# EAGLE schematic controller (EAGLE 6.1)
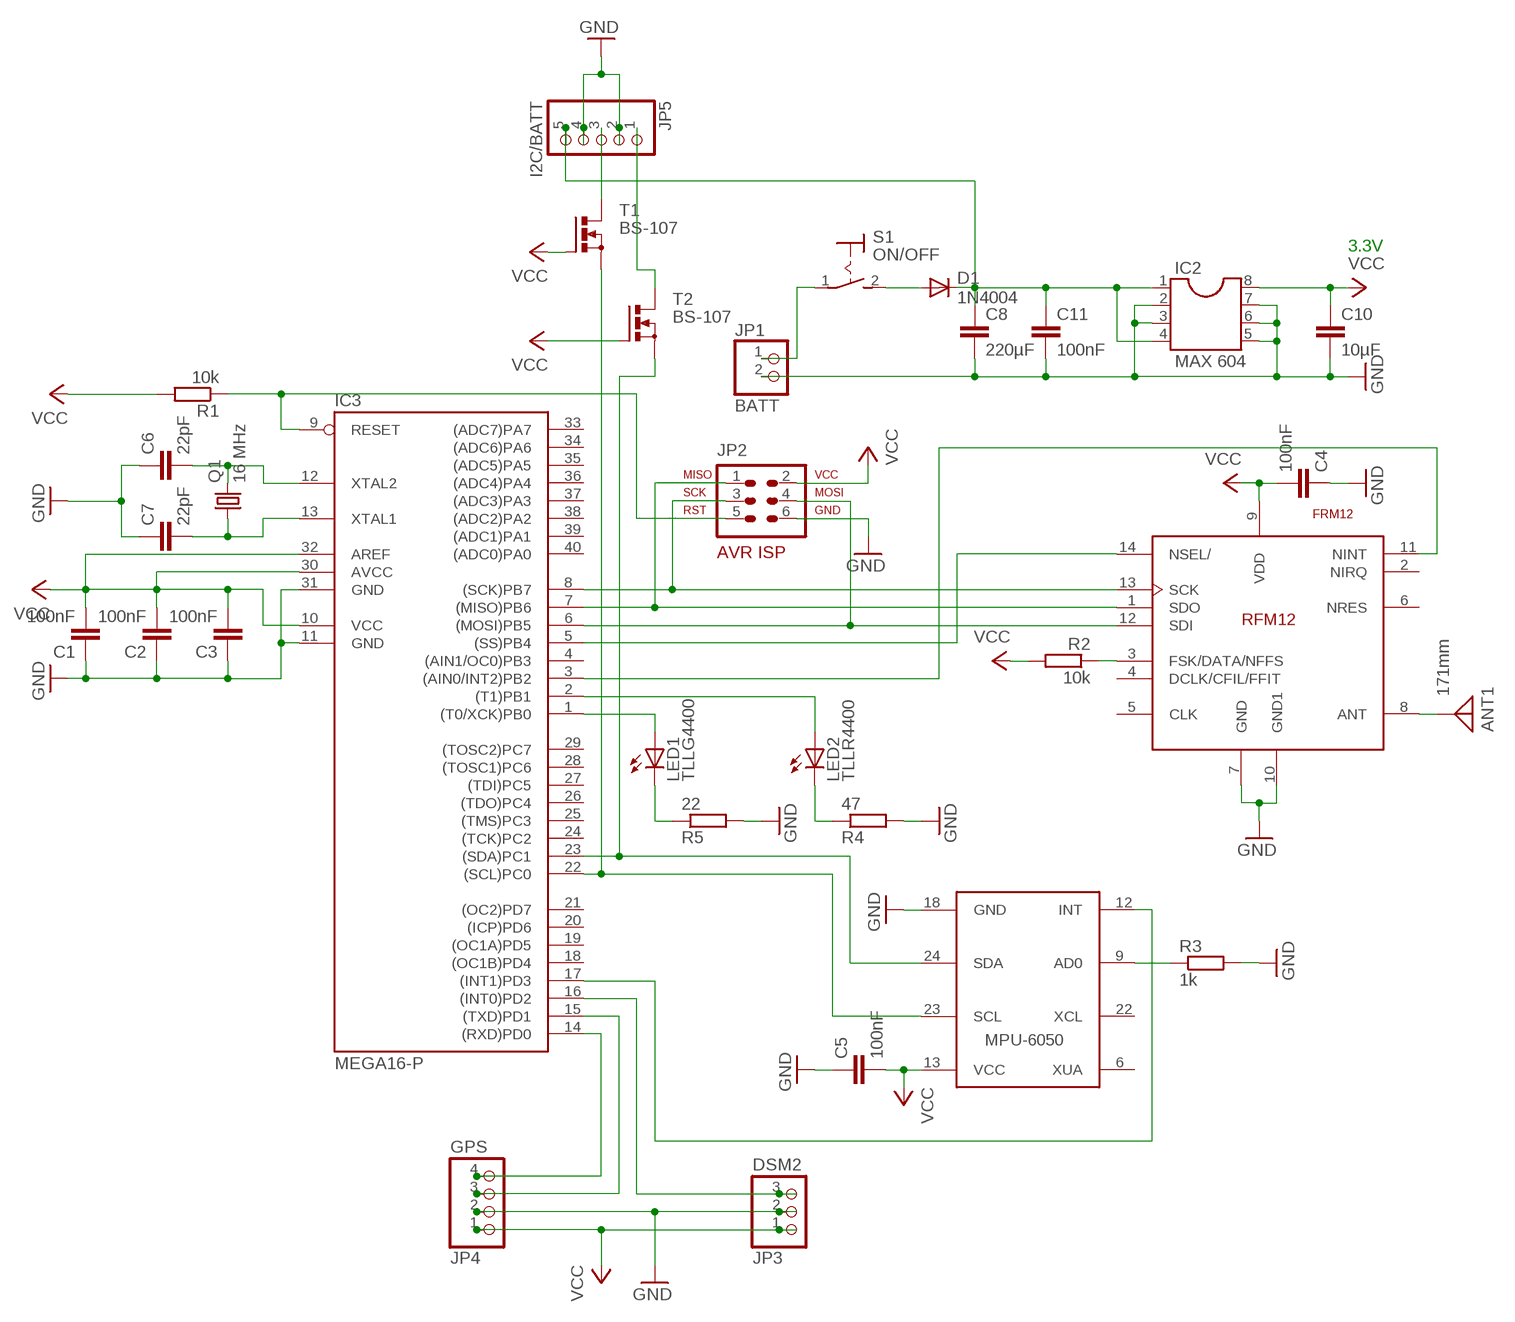
[diagram p0: schematic, sheet 1]

## Parts
ANT1  171mm  ANTENNA  [PAD-01]
C1  100nF  C2.5/2  [C2.5-2]
C2  100nF  C2.5/2  [C2.5-2]
C3  100nF  C2.5/2  [C2.5-2]
C4  100nF  C2.5/2  [C2.5-2]
C5  100nF  C2.5/2  [C2.5-2]
C6  22pF  C2.5/2  [C2.5-2]
C7  22pF  C2.5/2  [C2.5-2]
C8  220µF  C2.5/6  [C2.5-6]
C10  10µF  C2.5/5  [C2.5-5]
C11  100nF  C2.5/2  [C2.5-2]
D1  1N4004  [DO41-10]
IC2  MAX 604  DIL8S  [SOCKET-08]
IC3  MEGA16-P  [DIL40]
JP1  BATT  PINHD-1X2  [1X02]
JP2  AVR-ISP-6VERT  [AVR-ISP-6]
JP3  DSM2  PINHD-1X3  [1X03]
JP4  GPS  PINHD-1X4  [1X04]
JP5  I2C/BATT  PINHD-1X5  [1X05]
LED1  TLLG4400  [LED3MM]
LED2  TLLR4400  [LED3MM]
Q1  16 MHz  CRYSTALHC49S  [HC49/S]
R1  10k  R-EU_0207/10  [0207/10]
R2  10k  R-EU_0207/10  [0207/10]
R3  1k  R-EU_0207/10  [0207/10]
R4  47  R-EU_0207/10  [0207/10]
R5  22  R-EU_0207/10  [0207/10]
S1  ON/OFF  MS243  [MS243]
T1  BS-107  PMOSFET_NTO220BV  [TO220BV]
T2  BS-107  PMOSFET_NTO220BV  [TO220BV]
U$1  MPU-6050  [MPU-6050]
U$2  FRM12  [RFM12]

## Nets
GND: C1.1 C2.1 C3.1 C4.1 C5.1 C6.1 C7.1 C8.2 C10.2 C11.2 IC2.2 IC2.3 IC2.5 IC2.6 IC2.7 IC3.11(GND) IC3.31(GND) JP1.2 JP2.6 JP3.2 JP4.2 JP5.2 JP5.4 R3.2 R4.2 R5.2 U$1.18(GND) U$2.7(GND) U$2.10(GND1)
N$1: C6.2 IC3.12(XTAL2) Q1.2
N$2: C7.2 IC3.13(XTAL1) Q1.1
N$3: IC3.3((AIN0/INT2)PB2) U$2.11(NINT)
N$4: D1.A S1.2(S)
N$5: R3.1 U$1.9(AD0)
N$6: JP1.1 S1.1(P)
N$7: IC3.15((TXD)PD1) JP4.3
N$8: IC3.14((RXD)PD0) JP4.4
N$9: IC3.9(RESET) JP2.5 R1.1
N$10: IC3.17((INT1)PD3) U$1.12(INT)
N$12: IC3.6((MOSI)PB5) JP2.4 U$2.12(SDI)
N$13: IC3.5((SS)PB4) U$2.14(NSEL/)
N$14: IC3.7((MISO)PB6) JP2.1 U$2.1(SDO)
N$15: IC3.8((SCK)PB7) JP2.3 U$2.13(SCK)
N$16: IC3.1((T0/XCK)PB0) LED1.A
N$17: IC3.22((SCL)PC0) T1.S U$1.23(SCL)
N$18: IC3.23((SDA)PC1) T2.S U$1.24(SDA)
N$19: IC3.2((T1)PB1) LED2.A
N$20: LED1.K(C) R5.1
N$21: LED2.K(C) R4.1
N$24: C8.1 C11.1 D1.C IC2.1 IC2.4 JP5.5
N$25: JP5.3 T1.D
N$26: JP5.1 T2.D
N$38: R2.1 U$2.3(FSK/DATA/NFFS)
N$42: ANT1.1 U$2.8(ANT)
N$54: IC3.16((INT0)PD2) JP3.3
VCC: C1.2 C2.2 C3.2 C5.2 C10.1 IC2.8 IC3.10(VCC) IC3.30(AVCC) IC3.32(AREF) JP2.2 JP3.1 JP4.1 R1.2 R2.2 T1.G T2.G U$1.13(VCC)
VDD: C4.2 U$2.9(VDD) ; supply symbol labelled VCC
Unconnected: IC3.4((AIN1/OC0)PB3) IC3.18((OC1B)PD4) IC3.19((OC1A)PD5) IC3.20((ICP)PD6) IC3.21((OC2)PD7) IC3.24((TCK)PC2) IC3.25((TMS)PC3) IC3.26((TDO)PC4) IC3.27((TDI)PC5) IC3.28((TOSC1)PC6) IC3.29((TOSC2)PC7) IC3.33((ADC7)PA7) IC3.34((ADC6)PA6) IC3.35((ADC5)PA5) IC3.36((ADC4)PA4) IC3.37((ADC3)PA3) IC3.38((ADC2)PA2) IC3.39((ADC1)PA1) IC3.40((ADC0)PA0) U$1.6(XUA) U$1.22(XCL) U$2.2(NIRQ) U$2.4(DCLK/CFIL/FFIT) U$2.5(CLK) U$2.6(NRES)

## Notes on the sheet
- 3.3V

## Library data of the parts
ANT1 = discrete:ANTENNA: Antenna
C1-C8 C10 C11 = capacitor-wima:C: CAPACITOR naming: grid - package width
D1 = diode:1N4004: DIODE general purpose rectifier, 1 A
IC2 = ic-package:DIL8: Dual In Line / Socket
IC3 = atmel:MEGA16-P: MICROCONTROLLER 16 Kbytes FLASH 1 kbytes SRAM 512 bytes EEPROM USART 8-channel 10 bit ADC Source: avr.lbr; MPN: ATMEGA16-16PU; OC_FARNELL: 9171142; OC_NEWARK: 01M6885
JP1 = pinhead:PINHD-1X2: PIN HEADER
JP2 = avr-7:AVR-ISP-6: AVR ISP-6 Serial Programming Header
JP3 = pinhead:PINHD-1X3: PIN HEADER
JP4 = pinhead:PINHD-1X4: PIN HEADER
JP5 = pinhead:PINHD-1X5: PIN HEADER
LED1 = led:TLLG4400: Low Current (2mA) LED 3 mm Tinted Diffused Package color GREEN Source: Data sheet <http://www.farnell.com/datasheets/391098.pdf>; MF: VISHAY SEMICONDUCTOR; OC_FARNELL: 1612435
LED2 = led:TLLR4400: Low Current (2mA) LED 3 mm Tinted Diffused Package color RED Source: Data sheet <http://www.farnell.com/datasheets/391100.pdf>; MF: VISHAY SEMICONDUCTOR; OC_FARNELL: 1612437
Q1 = crystal:CRYSTAL: CRYSTAL; OC_FARNELL: 1667008; OC_NEWARK: unknown
R1-R5 = resistor:R-EU_: RESISTOR, European symbol
S1 = switch:MS243: TOGGLE SWITCH
T1 T2 = transistor-power:PMOSFET_N: Power MOSFET N-Channel
U$1 = mpu6050:MPU-6050
U$2 = RFM12:FRM12